# Altium schematic sheet MCU.SchDoc
size A3
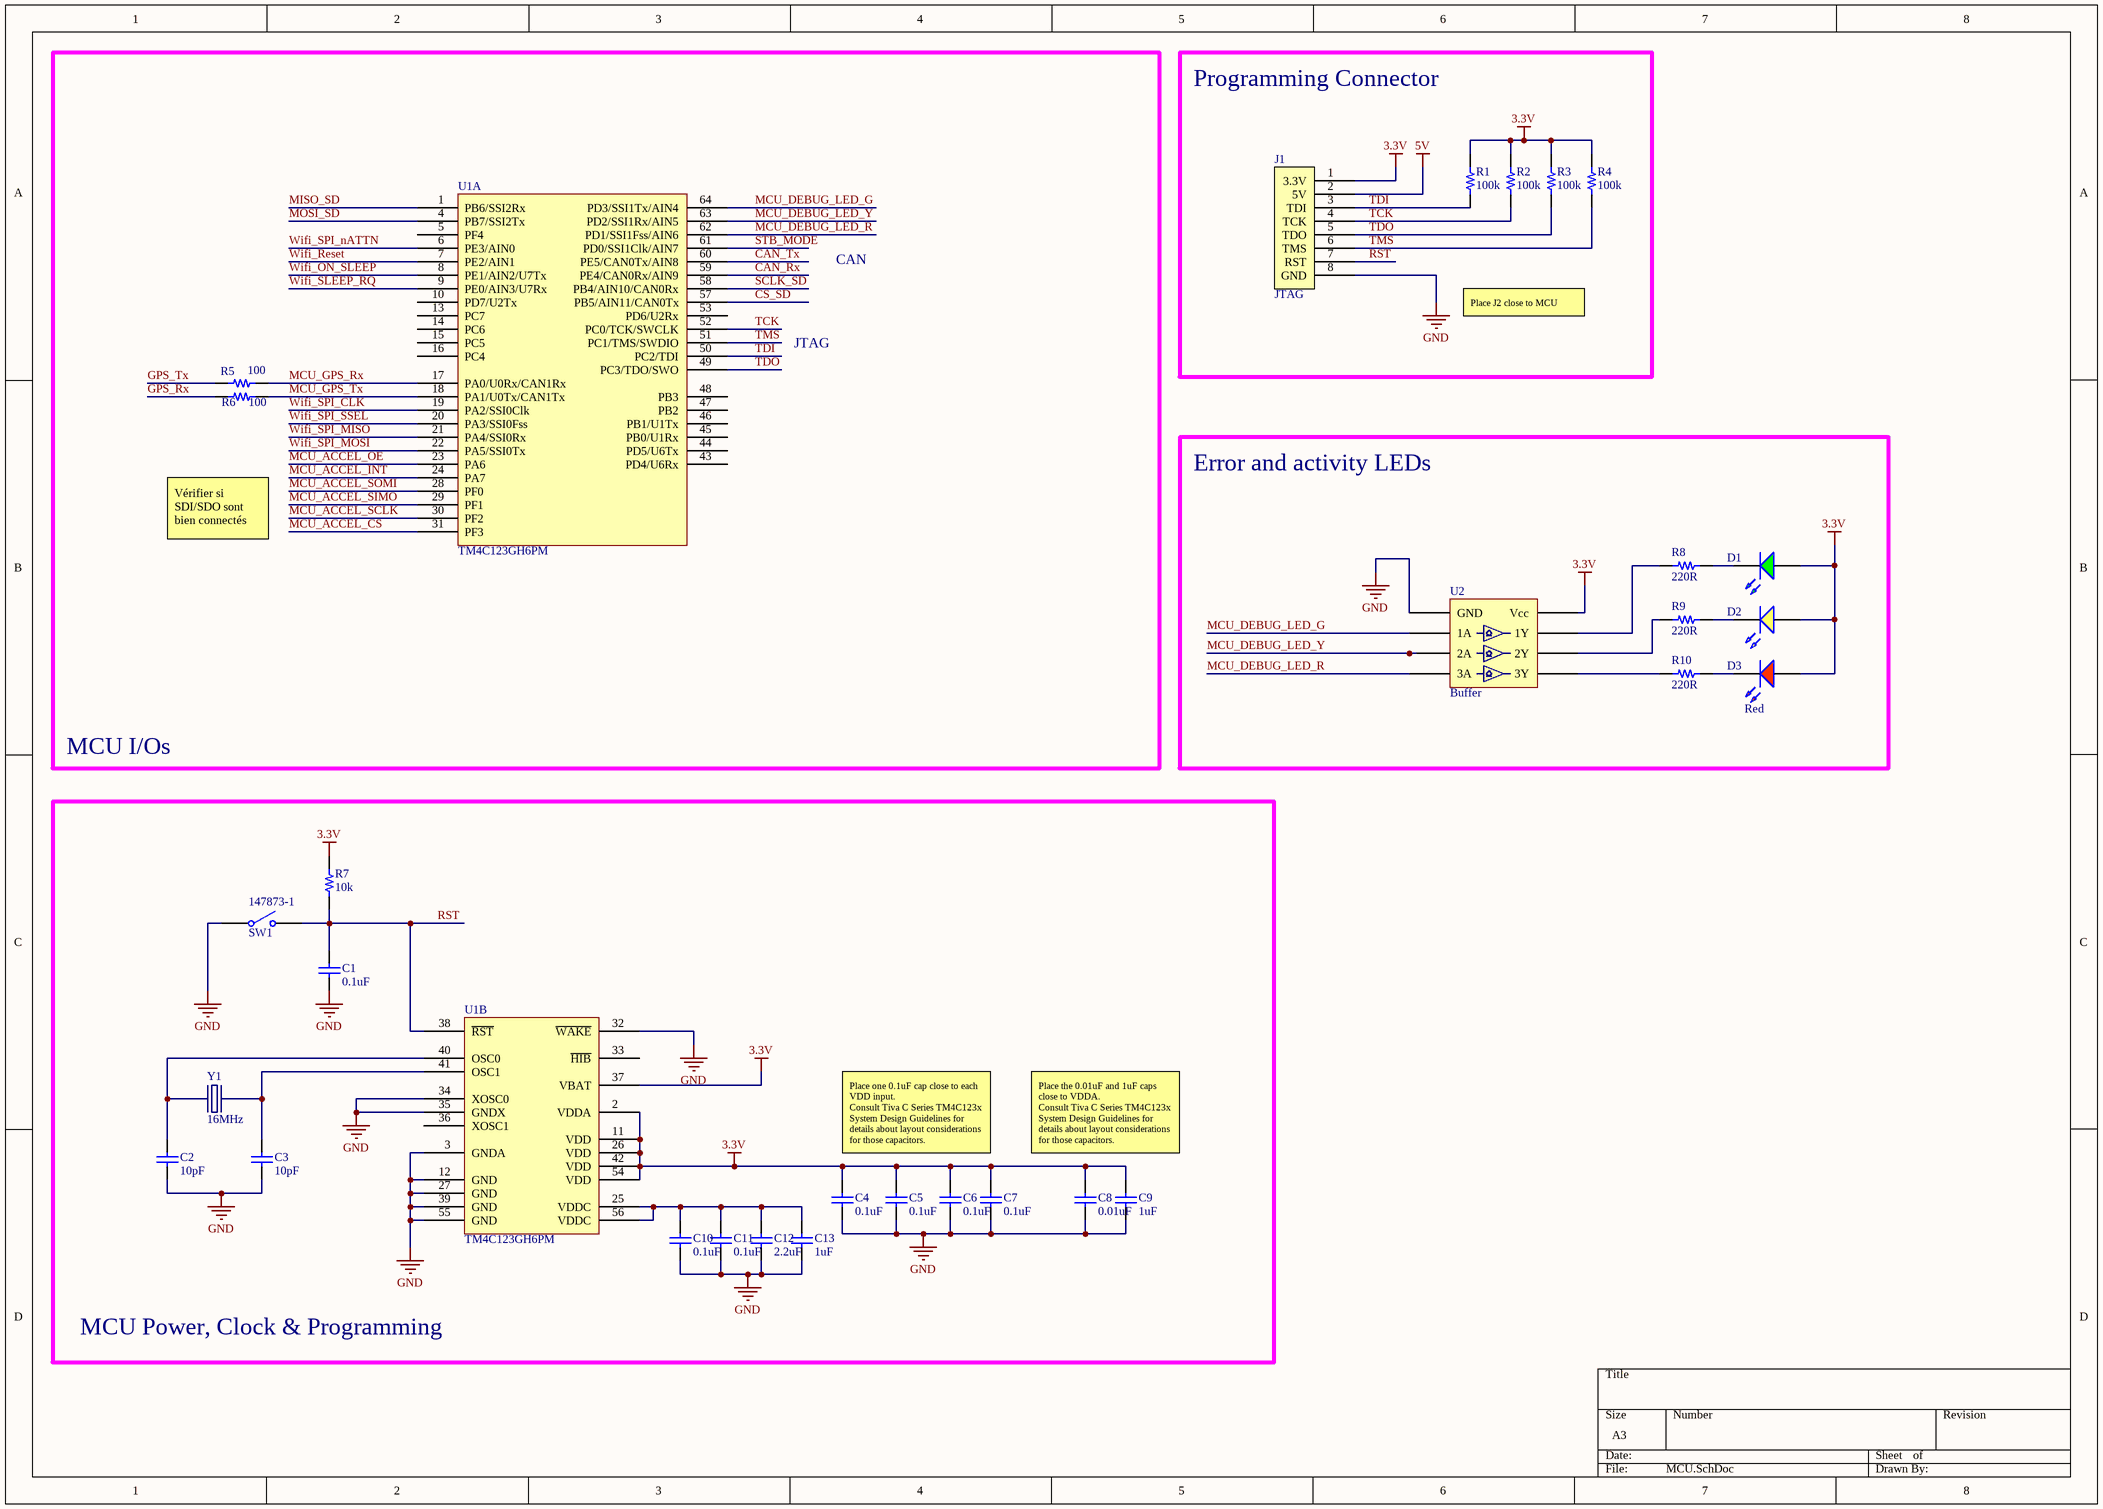
[diagram p0: MCU.SchDoc]

## Parts
C1  value 0.1uF  [C0603]  (hidden comment: CAP CER 0603 0.1uF 50V C0G 10%)
C2  value 10pF  [C0603]  (hidden comment: CAP CER 0603 10pF 50V C0G 5%)
C3  value 10pF  [C0603]  (hidden comment: CAP CER 0603 10pF 50V C0G 5%)
C4  value 0.1uF  [C0603]  (hidden comment: CAP CER 0603 0.1uF 50V C0G 10%)
C5  value 0.1uF  [C0603]  (hidden comment: CAP CER 0603 0.1uF 50V C0G 10%)
C6  value 0.1uF  [C0603]  (hidden comment: CAP CER 0603 0.1uF 50V C0G 10%)
C7  value 0.1uF  [C0603]  (hidden comment: CAP CER 0603 0.1uF 50V C0G 10%)
C8  value 0.01uF  [C0603]  (hidden comment: CAP CER 0603 0.01uF 50V X7R 10%)
C9  value 1uF  [C0603]  (hidden comment: CAP CER 0603 1uF 25V X7R 20%)
C10  value 0.1uF  [C0603]  (hidden comment: CAP CER 0603 0.1uF 50V C0G 10%)
C11  value 0.1uF  [C0603]  (hidden comment: CAP CER 0603 0.1uF 50V C0G 10%)
C12  value 2.2uF  [C0603]  (hidden comment: CAP CER 0603 2.2uF 6.3V X7R 10%)
C13  value 1uF  [C0603]  (hidden comment: CAP CER 0603 1uF 25V X7R 20%)
D1  Green LED  [LED1206]  (value not drawn)
D2  Yellow  [LED1206]  (value not drawn)
D3  Red  [LED1206]
J1  JTAG  [JTAG_Header]
R1  value 100k  [R0603]  (hidden comment: RES 0603 100k 5% 0.1W)
R2  value 100k  [R0603]  (hidden comment: RES 0603 100k 5% 0.1W)
R3  value 100k  [R0603]  (hidden comment: RES 0603 100k 5% 0.1W)
R4  value 100k  [R0603]  (hidden comment: RES 0603 100k 5% 0.1W)
R5  value 100  [R0603]  (hidden comment: RES 0603 100R 5% 1/4W)
R6  value 100  [R0603]  (hidden comment: RES 0603 100R 5% 1/4W)
R7  value 10k  [R0603]  (hidden comment: RES 0603 10k 5% 0.1W)
R8  value 220R  [R0603]  (hidden comment: RES 0603 220R 5% 0.25W)
R9  value 220R  [R0603]  (hidden comment: RES 0603 220R 5% 0.25W)
R10  value 220R  [R0603]  (hidden comment: RES 0603 220R 5% 0.25W)
SW1  147873-1  [147873]
U1  32-bit MCU  [LQFP-64]  (value not drawn)  (parts A,B of 2)
U2  Buffer  [8-VFSOP - TI - DCM (S-PDSO-G8)]
Y1  value 16MHz  [NX5032GA]  (hidden comment: NX5043GA-16.00MHz)

## Blocks framed on the sheet
MCU I/Os: R5 R6 U1
Programming Connector: J1 R1-R4
Error and activity LEDs: D1-D3 R8-R10 U2
MCU Power, Clock & Programming: C1-C13 R7 SW1 U1 Y1

## Nets
3.3V: C4.2 C5.2 C6.2 C7.2 C8.2 C9.2 D1.1(A) D2.1(A) D3.1(A) J1.1(3.3V) R1.2 R2.2 R3.2 R4.2 R7.2 U1.2(VDDA) U1.11(VDD) U1.26(VDD) U1.37(VBAT) U1.42(VDD) U1.54(VDD) U2.8(Vcc)
5V: J1.2(5V)
GND: C1.1 C2.1 C3.1 C4.1 C5.1 C6.1 C7.1 C8.1 C9.1 C10.1 C11.1 C12.1 C13.1 J1.8(GND) SW1.1(COMMON) U1.3(GNDA) U1.12(GND) U1.27(GND) U1.32(~{WAKE}) U1.34(XOSC0) U1.35(GNDX) U1.39(GND) U1.55(GND) U2.4(GND)
CAN_Rx: U1.59(PE4/CAN0Rx/AIN9)
CAN_Tx: U1.60(PE5/CAN0Tx/AIN8)
CS_SD: U1.57(PB5/AIN11/CAN0Tx)
GPS_Rx: R6.2
GPS_Tx: R5.2
MCU_ACCEL_CS: U1.31(PF3)
MCU_ACCEL_INT: U1.24(PA7)
MCU_ACCEL_OE: U1.23(PA6)
MCU_ACCEL_SCLK: U1.30(PF2)
MCU_ACCEL_SIMO: U1.29(PF1)
MCU_ACCEL_SOMI: U1.28(PF0)
MCU_DEBUG_LED_G: U1.64(PD3/SSI1Tx/AIN4) U2.1(1A)
MCU_DEBUG_LED_R: U1.62(PD1/SSI1Fss/AIN6) U2.6(3A)
MCU_DEBUG_LED_Y: U1.63(PD2/SSI1Rx/AIN5) U2.3(2A)
MCU_GPS_Rx: R5.1 U1.17(PA0/U0Rx/CAN1Rx)
MCU_GPS_Tx: R6.1 U1.18(PA1/U0Tx/CAN1Tx)
MISO_SD: U1.1(PB6/SSI2Rx)
MOSI_SD: U1.4(PB7/SSI2Tx)
RST: C1.2 J1.7(RST) R7.1 SW1.2(NO) U1.38(~{RST})
SCLK_SD: U1.58(PB4/AIN10/CAN0Rx)
STB_MODE: U1.61(PD0/SSI1Clk/AIN7)
TCK: J1.4(TCK) R2.1 U1.52(PC0/TCK/SWCLK)
TDI: J1.3(TDI) R1.1 U1.50(PC2/TDI)
TDO: J1.5(TDO) R3.1 U1.49(PC3/TDO/SWO)
TMS: J1.6(TMS) R4.1 U1.51(PC1/TMS/SWDIO)
Wifi_ON_SLEEP: U1.8(PE1/AIN2/U7Tx)
Wifi_Reset: U1.7(PE2/AIN1)
Wifi_SLEEP_RQ: U1.9(PE0/AIN3/U7Rx)
Wifi_SPI_CLK: U1.19(PA2/SSI0Clk)
Wifi_SPI_MISO: U1.21(PA4/SSI0Rx)
Wifi_SPI_MOSI: U1.22(PA5/SSI0Tx)
Wifi_SPI_nATTN: U1.6(PE3/AIN0)
Wifi_SPI_SSEL: U1.20(PA3/SSI0Fss)
NetC2_2: C2.2 U1.40(OSC0) Y1.1
NetC3_2: C3.2 U1.41(OSC1) Y1.2
NetC10_2: C10.2 C11.2 C12.2 C13.2 U1.25(VDDC) U1.56(VDDC)
NetD1_2: D1.2(K) R8.2
NetD2_2: D2.2(K) R9.2
NetD3_2: D3.2(K) R10.2
NetR8_1: R8.1 U2.7(1Y)
NetR9_1: R9.1 U2.5(2Y)
NetR10_1: R10.1 U2.2(3Y)

Not connected (* = marked no-connect by the designer): U1 5(PF4) 10(PD7/U2Tx) 13(PC7) 14(PC6) 15(PC5) 16(PC4) 33(~{HIB}) 36(XOSC1) 43(PD4/U6Rx) 44(PD5/U6Tx) 45(PB0/U1Rx) 46(PB1/U1Tx) 47(PB2) 48(PB3) 53(PD6/U2Rx)

## Notes on the sheet
- CAN
- Place J2 close to MCU
- JTAG
- Vérifier si SDI/SDO sont bien connectés
- Place one 0.1uF cap close to each VDD input.
  Consult Tiva C Series TM4C123x System Design Guidelines for details about layout considerations for those capacitors.
- Place the 0.01uF and 1uF caps close to VDDA.
  Consult Tiva C Series TM4C123x System Design Guidelines for details about layout considerations for those capacitors.

## Library data of the parts
C1 C4-C7 C10 C11 = CAP CER 0603 0.1uF 50V C0G 10%: 0.1uF ceramic capacitor; Manufacturer: TDK Corporation; Part_Number: CGA3E2X7R1H104K080AA; Supplier_Link: http://www.digikey.ca/product-detail/en/CGA3E2X7R1H104K080AA/445-5666-1-ND/2443706; Tolerance: 10%; Voltage rating: 50V; Price: 0.14; Price_10: 0.102
C2 C3 = CAP CER 0603 10pF 50V C0G 5%: 10pF ceramic capacitor; Manufacturer: TDK Corporation; Part_Number: CGA3E2C0G1H100D080AA; Supplier_Link: http://www.digikey.ca/product-detail/en/CGA3E2C0G1H100D080AA/445-5628-1-ND/2443668; Tolerance: 5%; Voltage rating: 50V; Price: 0.14; Price_10: 0.077
C8 = CAP CER 0603 0.01uF 50V X7R 10%: 0.01uF ceramic capacitor; Manufacturer: TDK Corporation; Part_Number: CGA3E2X7R1H103K080AA; Supplier_Link: http://www.digikey.ca/product-detail/en/CGA3E2X7R1H103K080AA/445-5662-1-ND/2443702; Tolerance: 10%; Voltage rating: 50V; Price: 0.14; Price_10: 0.102
C9 C13 = CAP CER 0603 1uF 25V X7R 20%: 1uF ceramic capacitor; Manufacturer: TDK Corporation; Part_Number: CGA3E1X7R1E105M080AC; Supplier_Link: http://www.digikey.ca/product-detail/en/CGA3E1X7R1E105M080AC/445-12548-1-ND/3954214; Tolerance: 20%; Voltage rating: 25V; Price: 0.24; Price_10: 0.171
C12 = CAP CER 0603 2.2uF 6.3V X7R 10%: 2.2uF ceramic capacitor; Manufacturer: TDK Corporation; Part_Number: CGA3E1X7R0J225K080AC; Supplier_Link: http://www.digikey.ca/product-detail/en/CGA3E1X7R0J225K080AC/445-6933-1-ND/2672951; Tolerance: 10%; Voltage rating: 6.3V; Price: 0.34; Price_10: 0.235
D1 = LTST-C150KGKT: Green LED 1206; Manufacturer: Liteon; Supplier_Link: http://www.digikey.ca/product-detail/en/LTST-C150KGKT/160-1404-1-ND/386759; Price: 0.55; Price_10: 0.40; Part_Number: LTST-C150KGKT
D2 = LTST-C150KSKT: Yellow LED 1206; Manufacturer: Liteon; Supplier_Link: http://www.digikey.ca/product-detail/en/LTST-C150KSKT/160-1406-1-ND/386762; Price: 0.55; Price_10: 0.40; Part_Number: LTST-C150KSKT
D3 = LTST-C150KRKT: Red LED 1206; Manufacturer: Liteon; Supplier_Link: http://www.digikey.ca/product-detail/en/LTST-C150KRKT/160-1405-1-ND/386760; Price: 0.55; Price_10: 0.40; Part_Number: LTST-C150KRKT
J1 = JTAG_Header: JTAG header, MCU programming
R1-R4 = RES 0603 100k 5% 0.1W: 100 kOhm resistor; Part_Number: CRCW0603100KJNEA; Manufacturer: Vishay; Price: 0.15; Supplier_Link: http://www.digikey.ca/product-detail/en/CRCW0603100KJNEA/541-100KGCT-ND/1179417; Price_10: 0.033
R5 R6 = RES 0603 100R 5% 1/4W: 100 Ohms resistor, 1/4W; Part_Number: ESR03EZPJ101; Manufacturer: Rohm Semiconductor; Price: 0.15; Supplier_Link: http://www.digikey.ca/product-detail/en/ESR03EZPJ101/RHM100DCT-ND/1983776; Price_10: 0.12
R7 = RES 0603 10k 5% 0.1W: 10 kOhms resistor; Part_Number: CRCW060310K0JNEA; Manufacturer: Vishay; Price: 0.15; Supplier_Link: http://www.digikey.ca/product-detail/en/CRCW060310K0JNEA/541-10KGCT-ND/1179393; Price_10: 0.033
R8-R10 = RES 0603 220R 5% 0.25W: 220 Ohms 0.25W Resistor; Part_Number: ESR03EZPJ221; Manufacturer: Rohm Semiconductor; Price: 0.15; Supplier_Link: http://www.digikey.ca/product-detail/en/ESR03EZPJ221/RHM220DCT-ND/1983788; Power: 0.25W; Supplier 1: Digi-Key; Supplier Part Number 1: RHM220DCT-ND; Tolerance: 5%
SW1 = 147873-1: Pushbutton switch SPST, 2 pins; Manufacturer: TE Connectivity; Supplier_Link: http://ca.mouser.com/ProductDetail/TE-Connectivity-Alcoswitch/147873-1/?qs=sGAEpiMZZMvxtGF7dlGNpsxRhg8g8FqHC2R98arEfD8%3d; Price: 0.30; Part_Number: 147873-1
U1 = TM4C123GH6PM: High performance 32-bit ARM® Cortex®-M4F based MCU; Manufacturer: Texas Instruments; Sample_Link: http://www.ti.com/product/TM4C123GH6PM/samplebuy; Supplier 1: Digi-Key; Supplier Part Number 1: 296-35848-ND; Supplier_Link: http://www.digikey.ca/product-detail/en/TM4C123GH6PMI/296-35848-ND/4036462; Price: 16.430; Price_10: 14.8320; Part_Number: TM4C123GH6PM
U2 = SN74LVC3G07-Q1: Triple Buffer/Driver  With Open-drain Outputs; Manufacturer: Texas Instrument; Part_Number: SN74LVC3G07QDCURQ1; Sink current: 32 mA @ 4.5V; Note: Q1 (automotive) version only available in TSSOP50 footpring; Supplier 1: Digi-Key; Supplier Part Number 1: 296-23710-1-ND; Supplier_Link: http://www.digikey.ca/product-detail/en/texas-instruments/SN74LVC3G07QDCURQ1/296-23710-1-ND/1948115; Price: 0.94; Price_10: 0.811
Y1 = NX5043GA-16.00MHz: Crystal Oscillator 16 MHz; Manufacturer: NDK; Part_Number: NX5032GA-16.000M-LN-CD-1; ESR: 120 Ohms; Supplier_Link: http://www.digikey.ca/product-detail/en/NX5032GA-16.000000MHZ-LN-CD-1/644-1037-1-ND/1128909; Price: 0.95; Price_10: 0.796